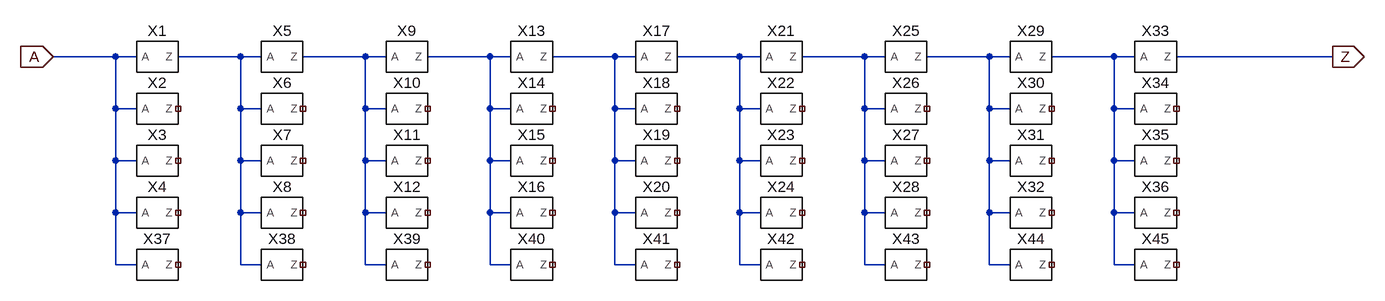
[diagram p0: schematic delay_chain.asc]
delay_chain.asc, the LTspice schematic file:
Version 4
SHEET 1 1928 680
WIRE -16 112 -112 112
WIRE 16 112 -16 112
WIRE 176 112 80 112
WIRE 208 112 176 112
WIRE 368 112 272 112
WIRE 400 112 368 112
WIRE 560 112 464 112
WIRE 592 112 560 112
WIRE 752 112 656 112
WIRE 784 112 752 112
WIRE 944 112 848 112
WIRE 976 112 944 112
WIRE 1136 112 1040 112
WIRE 1168 112 1136 112
WIRE 1328 112 1232 112
WIRE 1360 112 1328 112
WIRE 1520 112 1424 112
WIRE 1552 112 1520 112
WIRE 1856 112 1616 112
WIRE -16 192 -16 112
WIRE 16 192 -16 192
WIRE 176 192 176 112
WIRE 208 192 176 192
WIRE 368 192 368 112
WIRE 400 192 368 192
WIRE 560 192 560 112
WIRE 592 192 560 192
WIRE 752 192 752 112
WIRE 784 192 752 192
WIRE 944 192 944 112
WIRE 976 192 944 192
WIRE 1136 192 1136 112
WIRE 1168 192 1136 192
WIRE 1328 192 1328 112
WIRE 1360 192 1328 192
WIRE 1520 192 1520 112
WIRE 1552 192 1520 192
WIRE -16 272 -16 192
WIRE 16 272 -16 272
WIRE 176 272 176 192
WIRE 208 272 176 272
WIRE 368 272 368 192
WIRE 400 272 368 272
WIRE 560 272 560 192
WIRE 592 272 560 272
WIRE 752 272 752 192
WIRE 784 272 752 272
WIRE 944 272 944 192
WIRE 976 272 944 272
WIRE 1136 272 1136 192
WIRE 1168 272 1136 272
WIRE 1328 272 1328 192
WIRE 1360 272 1328 272
WIRE 1520 272 1520 192
WIRE 1552 272 1520 272
WIRE -16 352 -16 272
WIRE 16 352 -16 352
WIRE 176 352 176 272
WIRE 208 352 176 352
WIRE 368 352 368 272
WIRE 400 352 368 352
WIRE 560 352 560 272
WIRE 592 352 560 352
WIRE 752 352 752 272
WIRE 784 352 752 352
WIRE 944 352 944 272
WIRE 976 352 944 352
WIRE 1136 352 1136 272
WIRE 1168 352 1136 352
WIRE 1328 352 1328 272
WIRE 1360 352 1328 352
WIRE 1520 352 1520 272
WIRE 1552 352 1520 352
WIRE -16 432 -16 352
WIRE 16 432 -16 432
WIRE 176 432 176 352
WIRE 208 432 176 432
WIRE 368 432 368 352
WIRE 400 432 368 432
WIRE 560 432 560 352
WIRE 592 432 560 432
WIRE 752 432 752 352
WIRE 784 432 752 432
WIRE 944 432 944 352
WIRE 976 432 944 432
WIRE 1136 432 1136 352
WIRE 1168 432 1136 432
WIRE 1328 432 1328 352
WIRE 1360 432 1328 432
WIRE 1520 432 1520 352
WIRE 1552 432 1520 432
FLAG -112 112 A
IOPIN -112 112 In
FLAG 1856 112 Z
IOPIN 1856 112 Out
SYMBOL inv 48 112 R0
SYMATTR InstName X1
SYMBOL inv 48 192 R0
SYMATTR InstName X2
SYMBOL inv 48 272 R0
SYMATTR InstName X3
SYMBOL inv 48 352 R0
SYMATTR InstName X4
SYMBOL inv 240 112 R0
SYMATTR InstName X5
SYMBOL inv 240 192 R0
SYMATTR InstName X6
SYMBOL inv 240 272 R0
SYMATTR InstName X7
SYMBOL inv 240 352 R0
SYMATTR InstName X8
SYMBOL inv 432 112 R0
SYMATTR InstName X9
SYMBOL inv 432 192 R0
SYMATTR InstName X10
SYMBOL inv 432 272 R0
SYMATTR InstName X11
SYMBOL inv 432 352 R0
SYMATTR InstName X12
SYMBOL inv 624 112 R0
SYMATTR InstName X13
SYMBOL inv 624 192 R0
SYMATTR InstName X14
SYMBOL inv 624 272 R0
SYMATTR InstName X15
SYMBOL inv 624 352 R0
SYMATTR InstName X16
SYMBOL inv 816 112 R0
SYMATTR InstName X17
SYMBOL inv 816 192 R0
SYMATTR InstName X18
SYMBOL inv 816 272 R0
SYMATTR InstName X19
SYMBOL inv 816 352 R0
SYMATTR InstName X20
SYMBOL inv 1008 112 R0
SYMATTR InstName X21
SYMBOL inv 1008 192 R0
SYMATTR InstName X22
SYMBOL inv 1008 272 R0
SYMATTR InstName X23
SYMBOL inv 1008 352 R0
SYMATTR InstName X24
SYMBOL inv 1200 112 R0
SYMATTR InstName X25
SYMBOL inv 1200 192 R0
SYMATTR InstName X26
SYMBOL inv 1200 272 R0
SYMATTR InstName X27
SYMBOL inv 1200 352 R0
SYMATTR InstName X28
SYMBOL inv 1392 112 R0
SYMATTR InstName X29
SYMBOL inv 1392 192 R0
SYMATTR InstName X30
SYMBOL inv 1392 272 R0
SYMATTR InstName X31
SYMBOL inv 1392 352 R0
SYMATTR InstName X32
SYMBOL inv 1584 112 R0
SYMATTR InstName X33
SYMBOL inv 1584 192 R0
SYMATTR InstName X34
SYMBOL inv 1584 272 R0
SYMATTR InstName X35
SYMBOL inv 1584 352 R0
SYMATTR InstName X36
SYMBOL inv 48 432 R0
SYMATTR InstName X37
SYMBOL inv 240 432 R0
SYMATTR InstName X38
SYMBOL inv 432 432 R0
SYMATTR InstName X39
SYMBOL inv 624 432 R0
SYMATTR InstName X40
SYMBOL inv 816 432 R0
SYMATTR InstName X41
SYMBOL inv 1008 432 R0
SYMATTR InstName X42
SYMBOL inv 1200 432 R0
SYMATTR InstName X43
SYMBOL inv 1392 432 R0
SYMATTR InstName X44
SYMBOL inv 1584 432 R0
SYMATTR InstName X45

The netlist it stands for:
* delay_chain.asc
XX1 A N001 inv  ; pins A Z
XX2 A NC_01 inv  ; pins A Z
XX3 A NC_02 inv  ; pins A Z
XX4 A NC_03 inv  ; pins A Z
XX5 N001 N002 inv  ; pins A Z
XX6 N001 NC_04 inv  ; pins A Z
XX7 N001 NC_05 inv  ; pins A Z
XX8 N001 NC_06 inv  ; pins A Z
XX9 N002 N003 inv  ; pins A Z
XX10 N002 NC_07 inv  ; pins A Z
XX11 N002 NC_08 inv  ; pins A Z
XX12 N002 NC_09 inv  ; pins A Z
XX13 N003 N004 inv  ; pins A Z
XX14 N003 NC_10 inv  ; pins A Z
XX15 N003 NC_11 inv  ; pins A Z
XX16 N003 NC_12 inv  ; pins A Z
XX17 N004 N005 inv  ; pins A Z
XX18 N004 NC_13 inv  ; pins A Z
XX19 N004 NC_14 inv  ; pins A Z
XX20 N004 NC_15 inv  ; pins A Z
XX21 N005 N006 inv  ; pins A Z
XX22 N005 NC_16 inv  ; pins A Z
XX23 N005 NC_17 inv  ; pins A Z
XX24 N005 NC_18 inv  ; pins A Z
XX25 N006 N007 inv  ; pins A Z
XX26 N006 NC_19 inv  ; pins A Z
XX27 N006 NC_20 inv  ; pins A Z
XX28 N006 NC_21 inv  ; pins A Z
XX29 N007 N008 inv  ; pins A Z
XX30 N007 NC_22 inv  ; pins A Z
XX31 N007 NC_23 inv  ; pins A Z
XX32 N007 NC_24 inv  ; pins A Z
XX33 N008 Z inv  ; pins A Z
XX34 N008 NC_25 inv  ; pins A Z
XX35 N008 NC_26 inv  ; pins A Z
XX36 N008 NC_27 inv  ; pins A Z
XX37 A NC_28 inv  ; pins A Z
XX38 N001 NC_29 inv  ; pins A Z
XX39 N002 NC_30 inv  ; pins A Z
XX40 N003 NC_31 inv  ; pins A Z
XX41 N004 NC_32 inv  ; pins A Z
XX42 N005 NC_33 inv  ; pins A Z
XX43 N006 NC_34 inv  ; pins A Z
XX44 N007 NC_35 inv  ; pins A Z
XX45 N008 NC_36 inv  ; pins A Z
.backanno
.end